# Altium project nnts.PrjPcb (part 1 of 3)
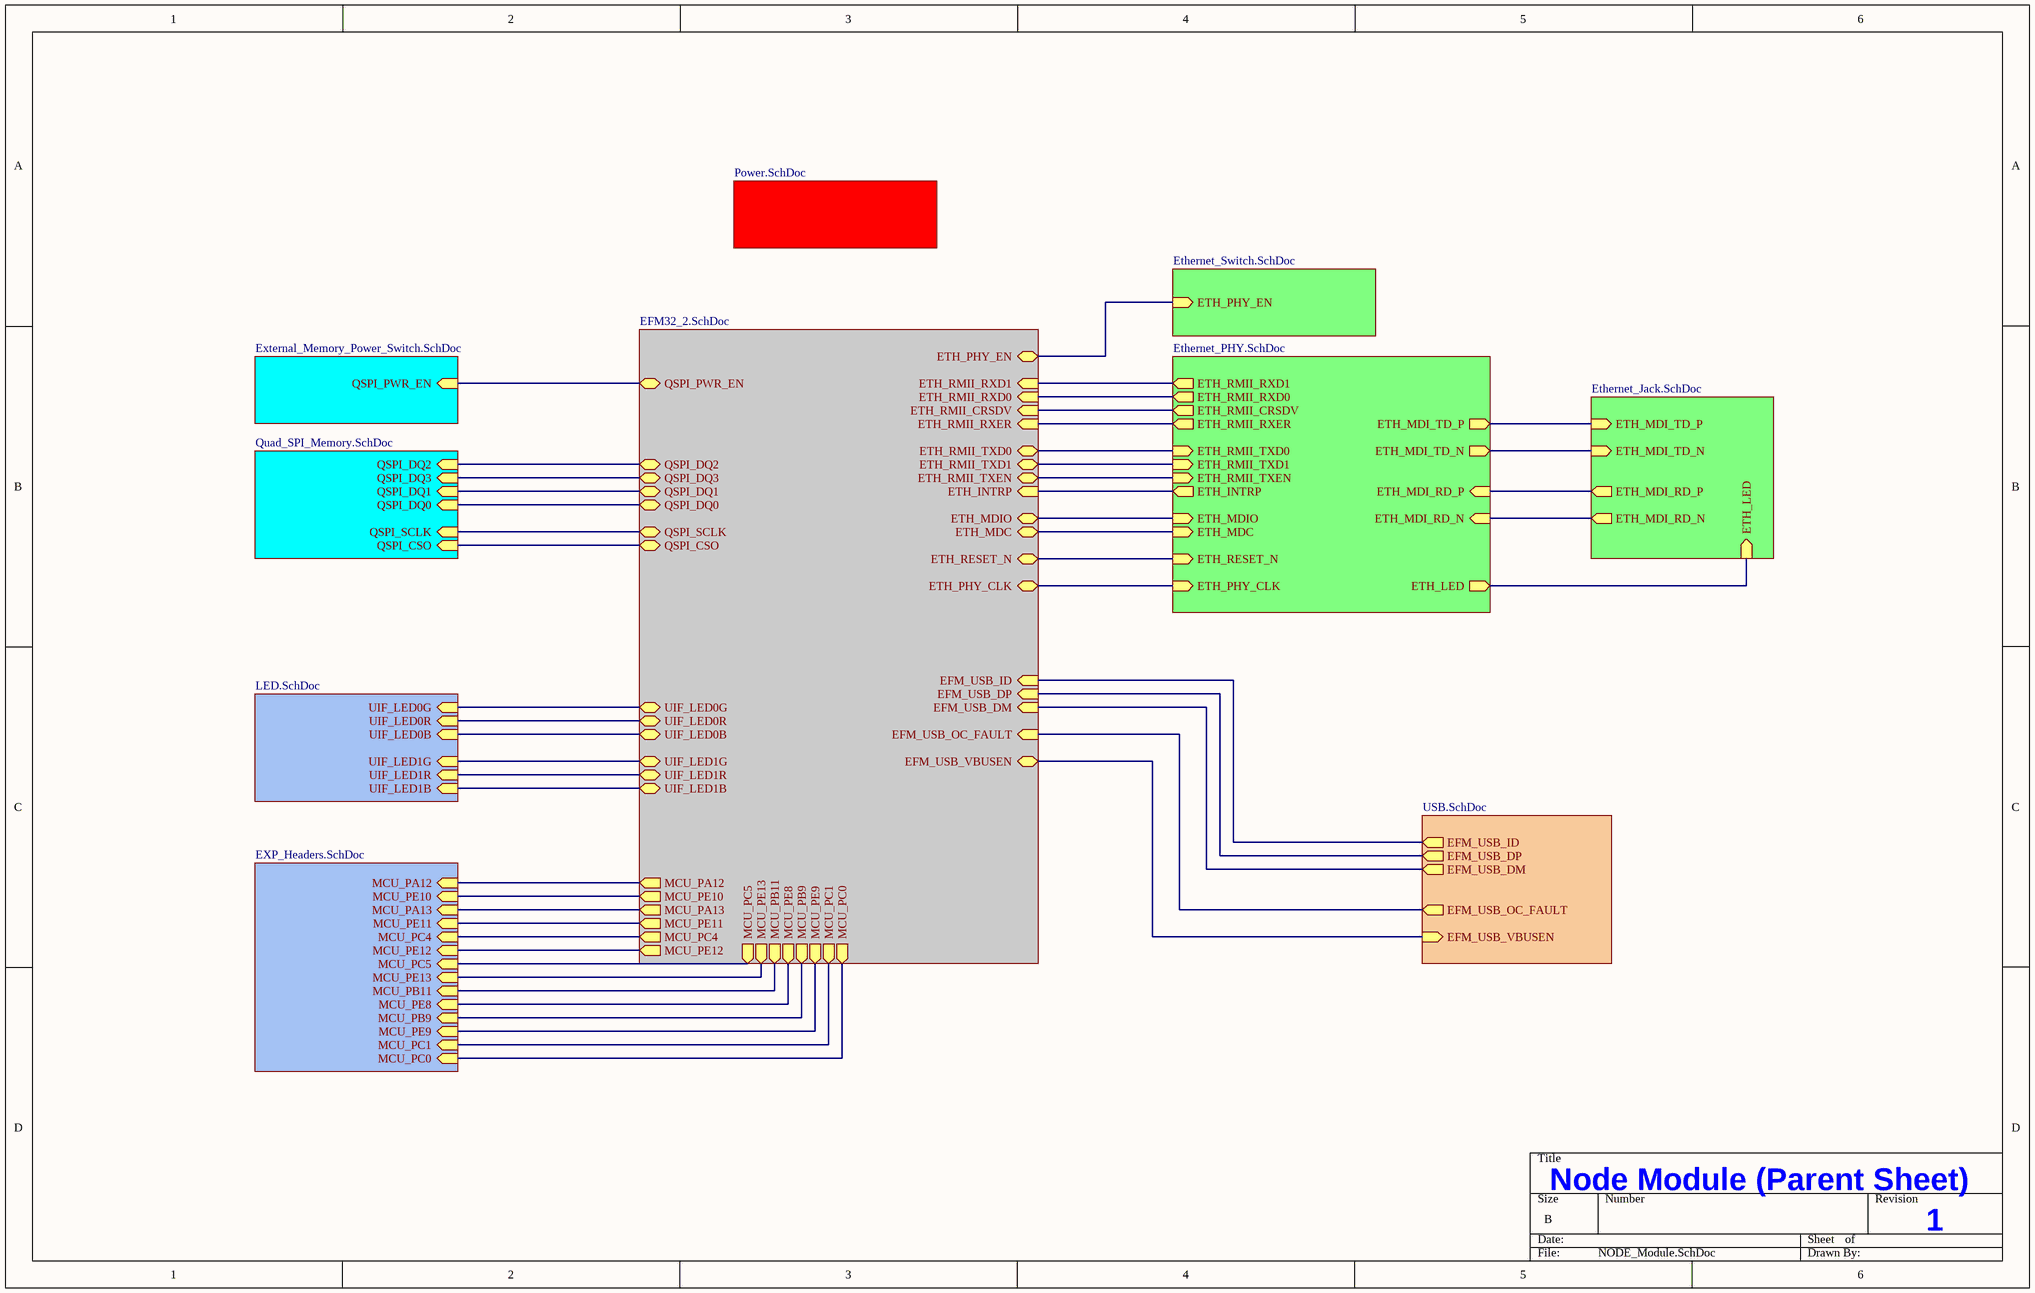
[diagram p0: NODE_Module.SchDoc]
Title: NNTS
11 sheets, 95 parts. Net scope: hierarchical (ports join the sheet entries above them; power ports are global).
Board file: NODE_Module.PcbDoc
Sheets:
  NODE_Module.SchDoc
    U_Ethernet_Jack = Ethernet_Jack.SchDoc
    U_Ethernet_Switch = Ethernet_Switch.SchDoc
    U_Quad_SPI_Memory = Quad_SPI_Memory.SchDoc
    U_External_Memory_Power_Switch = External_Memory_Power_Switch.SchDoc
    U_USB = USB.SchDoc
    U_Power = Power.SchDoc
    U_EXP_Headers = EXP_Headers.SchDoc
    U_LED = LED.SchDoc
    U_Ethernet_PHY = Ethernet_PHY.SchDoc
    U_EFM32_2 = EFM32_2.SchDoc

## Sheet NODE_Module.SchDoc: Node Module (Parent Sheet)
size B; CompanyName: OUTATIME; DrawnBy: Brad Yuska; Engineer: Brad Yuska; Revision: 1

### Sub-sheets
U_EFM32_2 = EFM32_2.SchDoc: QSPI_CSO (bidir), QSPI_DQ0 (bidir), QSPI_DQ1 (bidir), QSPI_DQ2 (bidir), QSPI_DQ3 (bidir), MCU_PC0 (out), MCU_PC1 (out), MCU_PC4 (out), MCU_PC5 (out), MCU_PA12 (out), MCU_PA13 (out), MCU_PB9 (out), MCU_PB11 (out), MCU_PE13 (out), MCU_PE12 (out), MCU_PE11 (out), MCU_PE10 (out), MCU_PE9 (out), MCU_PE8 (out), ETH_RMII_RXER (in), ETH_RMII_CRSDV (in), ETH_PHY_CLK (bidir), ETH_RMII_RXD0 (in), ETH_RMII_RXD1 (in), ETH_RMII_TXEN (bidir), ETH_RMII_TXD0 (bidir), ETH_RMII_TXD1 (bidir), EFM_USB_VBUSEN (bidir), EFM_USB_ID (in), ETH_INTRP (in), EFM_USB_DP (in), EFM_USB_DM (in), QSPI_SCLK (bidir), ETH_MDC (bidir), ETH_MDIO (bidir), ETH_PHY_EN (bidir), EFM_USB_OC_FAULT (in), UIF_LED0G (bidir), UIF_LED1R (bidir), UIF_LED0B (bidir), UIF_LED1G (bidir), UIF_LED1B (bidir), UIF_LED0R (bidir), ETH_RESET_N (bidir), QSPI_PWR_EN (bidir)
U_Ethernet_Jack = Ethernet_Jack.SchDoc: ETH_MDI_TD_P (in), ETH_MDI_TD_N (in), ETH_MDI_RD_P (out), ETH_MDI_RD_N (out), ETH_LED (in)
U_Ethernet_PHY = Ethernet_PHY.SchDoc: ETH_MDI_RD_N (in), ETH_MDI_RD_P (in), ETH_MDI_TD_N (out), ETH_MDI_TD_P (out), ETH_RESET_N (in), ETH_LED (out), ETH_INTRP (out), ETH_RMII_TXD1 (in), ETH_RMII_TXD0 (in), ETH_RMII_TXEN (in), ETH_RMII_RXD1 (out), ETH_RMII_RXD0 (out), ETH_RMII_RXER (out), ETH_RMII_CRSDV (out), ETH_PHY_CLK (in), ETH_MDIO (in), ETH_MDC (in)
U_Ethernet_Switch = Ethernet_Switch.SchDoc: ETH_PHY_EN (in)
U_EXP_Headers = EXP_Headers.SchDoc: MCU_PA12 (in), MCU_PE10 (in), MCU_PA13 (in), MCU_PE11 (in), MCU_PC4 (in), MCU_PE12 (in), MCU_PC5 (in), MCU_PE13 (in), MCU_PB11 (in), MCU_PE8 (in), MCU_PB9 (in), MCU_PE9 (in), MCU_PC1 (in), MCU_PC0 (in)
U_External_Memory_Power_Switch = External_Memory_Power_Switch.SchDoc: QSPI_PWR_EN (in)
U_LED = LED.SchDoc: UIF_LED0G (in), UIF_LED0R (in), UIF_LED0B (in), UIF_LED1G (in), UIF_LED1R (in), UIF_LED1B (in)
U_Power = Power.SchDoc: no entries
U_Quad_SPI_Memory = Quad_SPI_Memory.SchDoc: QSPI_DQ2 (in), QSPI_DQ3 (in), QSPI_DQ1 (in), QSPI_DQ0 (in), QSPI_SCLK (in), QSPI_CSO (in)
U_USB = USB.SchDoc: EFM_USB_VBUSEN (in), EFM_USB_OC_FAULT (out), EFM_USB_ID (out), EFM_USB_DP (out), EFM_USB_DM (out)

### Nets
NetD1_11: sheet U_Ethernet_Jack/ETH_MDI_RD_N, sheet U_Ethernet_PHY/ETH_MDI_RD_N
NetD1_12: sheet U_Ethernet_Jack/ETH_MDI_RD_P, sheet U_Ethernet_PHY/ETH_MDI_RD_P
NetD1_13: sheet U_Ethernet_Jack/ETH_MDI_TD_N, sheet U_Ethernet_PHY/ETH_MDI_TD_N
NetD1_14: sheet U_Ethernet_Jack/ETH_MDI_TD_P, sheet U_Ethernet_PHY/ETH_MDI_TD_P
NetD3_1: sheet U_USB/EFM_USB_ID, sheet U_EFM32_2/EFM_USB_ID
NetP2_3: sheet U_EXP_Headers/MCU_PA12, sheet U_EFM32_2/MCU_PA12
NetP2_4: sheet U_EXP_Headers/MCU_PE10, sheet U_EFM32_2/MCU_PE10
NetP2_5: sheet U_EXP_Headers/MCU_PA13, sheet U_EFM32_2/MCU_PA13
NetP2_6: sheet U_EXP_Headers/MCU_PE11, sheet U_EFM32_2/MCU_PE11
NetP2_7: sheet U_EXP_Headers/MCU_PC4, sheet U_EFM32_2/MCU_PC4
NetP2_8: sheet U_EXP_Headers/MCU_PE12, sheet U_EFM32_2/MCU_PE12
NetP2_9: sheet U_EXP_Headers/MCU_PC5, sheet U_EFM32_2/MCU_PC5
NetP2_10: sheet U_EXP_Headers/MCU_PE13, sheet U_EFM32_2/MCU_PE13
NetP2_11: sheet U_EXP_Headers/MCU_PB11, sheet U_EFM32_2/MCU_PB11
NetP2_12: sheet U_EXP_Headers/MCU_PE8, sheet U_EFM32_2/MCU_PE8
NetP2_13: sheet U_EXP_Headers/MCU_PB9, sheet U_EFM32_2/MCU_PB9
NetP2_14: sheet U_EXP_Headers/MCU_PE9, sheet U_EFM32_2/MCU_PE9
NetP2_15: sheet U_EXP_Headers/MCU_PC1, sheet U_EFM32_2/MCU_PC1
NetP2_16: sheet U_EXP_Headers/MCU_PC0, sheet U_EFM32_2/MCU_PC0
NetR1_1: sheet U_Ethernet_PHY/ETH_PHY_CLK, sheet U_EFM32_2/ETH_PHY_CLK
NetR2_2: sheet U_Ethernet_PHY/ETH_INTRP, sheet U_EFM32_2/ETH_INTRP
NetR3_1: sheet U_Ethernet_PHY/ETH_MDIO, sheet U_EFM32_2/ETH_MDIO
NetR9_1: sheet U_Ethernet_Jack/ETH_LED, sheet U_Ethernet_PHY/ETH_LED
NetR10_2: sheet U_Ethernet_Switch/ETH_PHY_EN, sheet U_EFM32_2/ETH_PHY_EN
NetR11_1: sheet U_Quad_SPI_Memory/QSPI_CSO, sheet U_EFM32_2/QSPI_CSO
NetR12_2: sheet U_Quad_SPI_Memory/QSPI_SCLK, sheet U_EFM32_2/QSPI_SCLK
NetR13_2: sheet U_External_Memory_Power_Switch/QSPI_PWR_EN, sheet U_EFM32_2/QSPI_PWR_EN
NetR15_2: sheet U_USB/EFM_USB_DP, sheet U_EFM32_2/EFM_USB_DP
NetR16_2: sheet U_USB/EFM_USB_DM, sheet U_EFM32_2/EFM_USB_DM
NetR17_1: sheet U_USB/EFM_USB_VBUSEN, sheet U_EFM32_2/EFM_USB_VBUSEN
NetR18_2: sheet U_USB/EFM_USB_OC_FAULT, sheet U_EFM32_2/EFM_USB_OC_FAULT
NetR22_1: sheet U_LED/UIF_LED0G, sheet U_EFM32_2/UIF_LED0G
NetR23_1: sheet U_LED/UIF_LED1G, sheet U_EFM32_2/UIF_LED1G
NetR24_1: sheet U_LED/UIF_LED0R, sheet U_EFM32_2/UIF_LED0R
NetR25_1: sheet U_LED/UIF_LED1R, sheet U_EFM32_2/UIF_LED1R
NetR26_1: sheet U_LED/UIF_LED0B, sheet U_EFM32_2/UIF_LED0B
NetR27_1: sheet U_LED/UIF_LED1B, sheet U_EFM32_2/UIF_LED1B
NetRP1_1: sheet U_Ethernet_PHY/ETH_RMII_RXD1, sheet U_EFM32_2/ETH_RMII_RXD1
NetRP1_2: sheet U_Ethernet_PHY/ETH_RMII_RXD0, sheet U_EFM32_2/ETH_RMII_RXD0
NetRP1_3: sheet U_Ethernet_PHY/ETH_RMII_RXER, sheet U_EFM32_2/ETH_RMII_RXER
NetRP1_4: sheet U_Ethernet_PHY/ETH_RMII_CRSDV, sheet U_EFM32_2/ETH_RMII_CRSDV
NetRP2_1: sheet U_Quad_SPI_Memory/QSPI_DQ3, sheet U_EFM32_2/QSPI_DQ3
NetRP2_2: sheet U_Quad_SPI_Memory/QSPI_DQ2, sheet U_EFM32_2/QSPI_DQ2
NetRP2_3: sheet U_Quad_SPI_Memory/QSPI_DQ1, sheet U_EFM32_2/QSPI_DQ1
NetRP2_4: sheet U_Quad_SPI_Memory/QSPI_DQ0, sheet U_EFM32_2/QSPI_DQ0
NetU1_11: sheet U_Ethernet_PHY/ETH_MDC, sheet U_EFM32_2/ETH_MDC
NetU1_19: sheet U_Ethernet_PHY/ETH_RMII_TXEN, sheet U_EFM32_2/ETH_RMII_TXEN
NetU1_20: sheet U_Ethernet_PHY/ETH_RMII_TXD0, sheet U_EFM32_2/ETH_RMII_TXD0
NetU1_21: sheet U_Ethernet_PHY/ETH_RMII_TXD1, sheet U_EFM32_2/ETH_RMII_TXD1
NetU1_24: sheet U_Ethernet_PHY/ETH_RESET_N, sheet U_EFM32_2/ETH_RESET_N

## Sheet Ethernet_Jack.SchDoc: Ethernet Jack
size A; Revision: 1
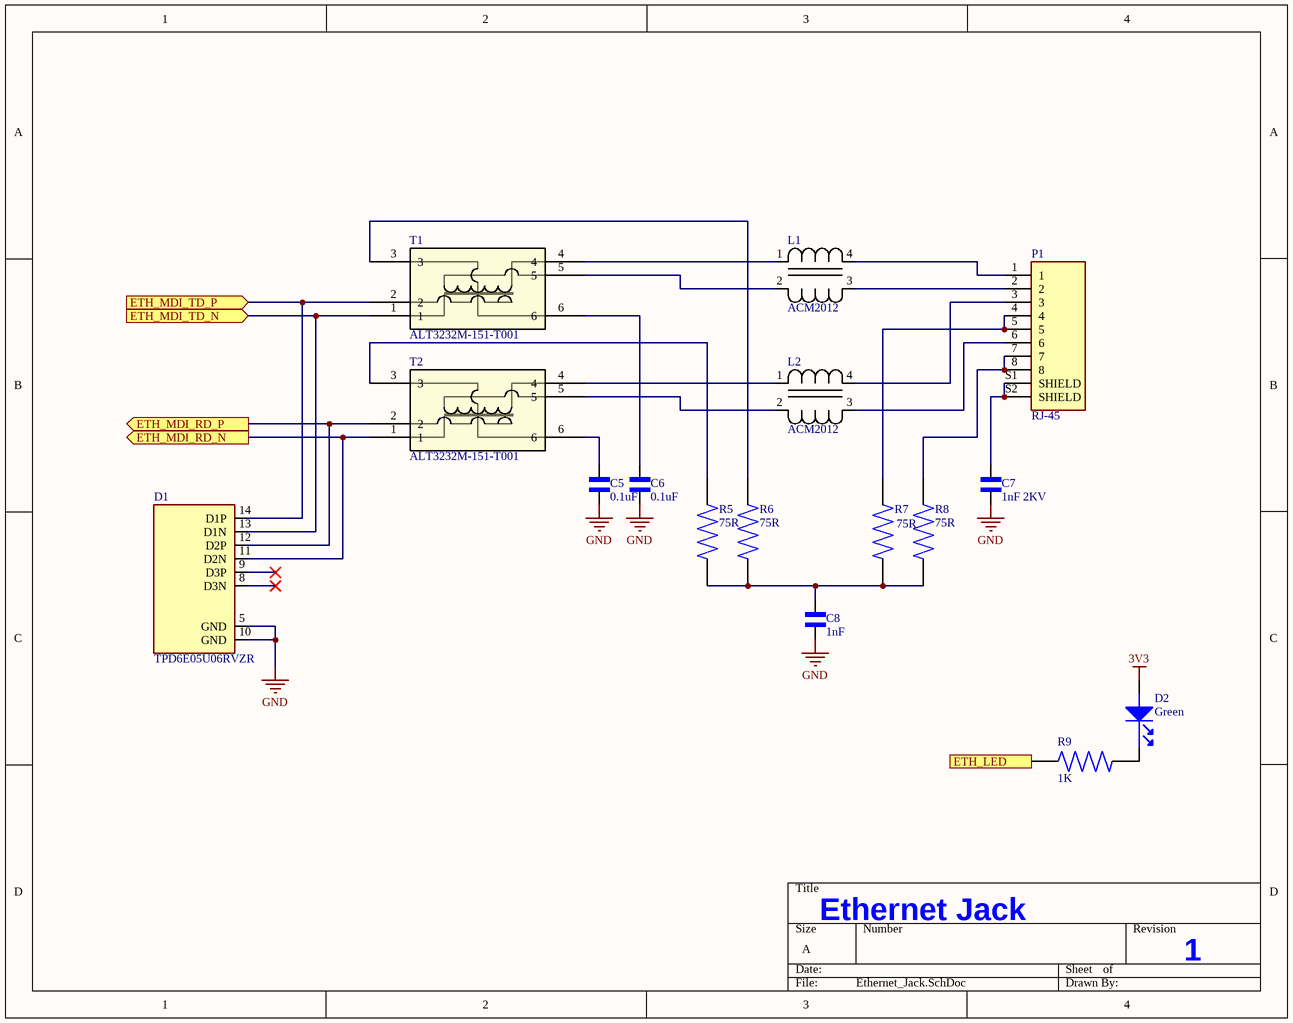
[diagram p1: Ethernet_Jack.SchDoc]

### Parts
C5  0.1uF  [C0402]
C6  0.1uF  [C0402]
C7  1nF 2KV  [RESC1206X70N]
C8  1nF  [C0402]
D1  TPD6E05U06RVZR  [SON50P135X350X55-14N]
D2  Green  [LED_0603]
L1  ACM2012  [IND_TDK_ACM2012_2P_TDK-M]
L2  ACM2012  [IND_TDK_ACM2012_2P_TDK-M]
P1  RJ-45  [TE_1-406541-5]
R5  75R  [R0402 Vishay]
R6  75R  [R0402 Vishay]
R7  75R  [R0402 Vishay]
R8  75R  [R0402 Vishay]
R9  1K  [R0603 Vishay]
T1  ALT3232M-151-T001  [ALT3232M-151-T001]
T2  ALT3232M-151-T001  [ALT3232M-151-T001]

### Ports
ETH_LED (in), ETH_MDI_RD_N (out), ETH_MDI_RD_P (out), ETH_MDI_TD_N (in), ETH_MDI_TD_P (in)

### Nets
3V3: D2.1(Anode)
GND: C5.1 C6.1 C7.1 C8.1 D1.5(GND) D1.10(GND)
NetC5_2: C5.2 T2.6
NetC6_2: C6.2 T1.6
NetC7_2: C7.2 P1.S1(SHIELD) P1.S2(SHIELD)
NetC8_2: C8.2 R5.1 R6.1 R7.1 R8.1
NetD1_11: D1.11(D2N) T2.1 ; port ETH_MDI_RD_N
NetD1_12: D1.12(D2P) T2.2 ; port ETH_MDI_RD_P
NetD1_13: D1.13(D1N) T1.1 ; port ETH_MDI_TD_N
NetD1_14: D1.14(D1P) T1.2 ; port ETH_MDI_TD_P
NetD2_2: D2.2(Cathode) R9.2
NetL1_1: L1.1 T1.4
NetL1_2: L1.2 T1.5
NetL1_3: L1.3 P1.2
NetL1_4: L1.4 P1.1
NetL2_1: L2.1 T2.4
NetL2_2: L2.2 T2.5
NetL2_3: L2.3 P1.6
NetL2_4: L2.4 P1.3
NetP1_4: P1.4 P1.5 R7.2
NetP1_7: P1.7 P1.8 R8.2
NetR5_2: R5.2 T2.3
NetR6_2: R6.2 T1.3
NetR9_1: R9.1 ; port ETH_LED

Not connected (* = marked no-connect by the designer): D1 8(D3N)* 9(D3P)*

### Library data of the parts
C5 C6 = GRM022R60J104KE15L: CAP CER 0.1UF 6.3V X5R 01005; Manufacturer: Murata; Capacitance: 100nF; Tolerance: 10%; Supplier 1: Digi-Key; Manufacturer Part Number: GRM022R60J104KE15L; RoHS: No; Category: Ceramic Capacitors; Stock 1: 633064; Pricing 1: 1=0.13000, 10=0.09000, 50=0.05080, 100=0.04210, 500=0.02952, 1000=0.02444, 2500=0.02275, 5000=0.02081 (USD); Mount: Surface Mount; Case Code (Imperial): 1005; Case Code (Metric): 0402; Min Operating Temperature: -55°C; Max Operating Temperature: 85°C; Packaging: Cut Tape; Voltage Rating: 6.3V; ComponentLink1URL: http://search.murata.co.jp/Ceramy/image/img/A01X/G101/ENG/GRM022R60J104KE15-01.pdf?src-supplier=Digi-Key; ComponentLink1Description: http://search.murata.co.jp/Ceramy/image/img/A01X/G101/ENG/GRM022R60J104KE15-01.pdf?src-supplier=Digi-Key; Supplier Part Number 1: 490-16598-1-ND
C7 = 1206GC102KAT3A: 1206 1000 pF 2000 V ±10 % Tolerance X7R SMT Multilayer Ceramic Capacitor; Manufacturer: Kyocera AVX; Tolerance: 10%; Supplier 1: Mouser; Manufacturer Part Number: 1206GC102KAT3A; RoHS: Yes; Category: Ceramic Capacitors; Stock 1: 40204; Pricing 1: 1=0.37000, 10=0.27700, 100=0.16600, 500=0.12500, 1000=0.10800, 2500=0.08900 (USD); Mount: Surface Mount; Case/Package: 1206; Case Code (Imperial): 1206; Case Code (Metric): 3216; Min Operating Temperature: -55°C; Max Operating Temperature: 125°C; Capacitance: 1nF; Packaging: Tape and Reel; Package Quantity: 10000; Voltage Rating: 2kV; Dielectric: X7R; Voltage Rating (DC): 2kV; Termination: SMD/SMT; Length: 3.2mm; Depth: 1.6mm; ComponentLink1URL: https://datasheet.ciiva.com/13205/aphvc-13205007.pdf?src-supplier=Mouser; ComponentLink1Description: https://datasheet.ciiva.com/13205/aphvc-13205007.pdf?src-supplier=Mouser; Supplier Part Number 1: 581-1206GC102KAT3A
C8 = GRM155R60J102KA01D: 0402 1 nF 6.3 V ±10% Tolerance X5R SMT Multilayer Ceramic Capacitor; Manufacturer: Murata; Voltage Rating: 6.3V; Supplier 1: Digi-Key; Manufacturer Part Number: GRM155R60J102KA01D; RoHS: Yes; Category: Ceramic Capacitors; Stock 1: 20431; Pricing 1: 1=0.10000, 10=0.02800, 50=0.01520, 100=0.01240, 500=0.00886, 1000=0.00696, 2500=0.00632, 5000=0.00582 (USD); Mount: Surface Mount; Case/Package: 0402; Case Code (Metric): 1005; Case Code (Imperial): 0402; Min Operating Temperature: -55°C; Max Operating Temperature: 85°C; Package Quantity: 10000; Capacitance: 1nF; Tolerance: 10%; Packaging: Tape and Reel; Voltage Rating (DC): 6.3V; Dielectric: X5R; Termination: SMD/SMT; Voltage: 6.3V; Length: 1mm; Width: 0.02inch; Height: 0.5mm; Thickness: 0.022inch; Depth: 0.5mm; Radiation Hardening: No; Lead Free: Lead Free; ComponentLink1URL: https://datasheet.ciiva.com/6263/product-6263681.pdf?src-supplier=Digi-Key; ComponentLink1Description: https://datasheet.ciiva.com/6263/product-6263681.pdf?src-supplier=Digi-Key; ComponentLink2URL: https://datasheet.ciiva.com/6263/partnumbering-e-01-6263685.pdf?src-supplier=Digi-Key; ComponentLink2Description: https://datasheet.ciiva.com/6263/partnumbering-e-01-6263685.pdf?src-supplier=Digi-Key; ComponentLink3URL: https://datasheet.ciiva.com/6263/partnumbering-e-01-6263677.pdf?src-supplier=Digi-Key; ComponentLink3Description: https://datasheet.ciiva.com/6263/partnumbering-e-01-6263677.pdf?src-supplier=Digi-Key; Supplier Part Number 1: 490-6285-1-ND
D1 = TPD6E05U06RVZR: TVS DIODE 5.5V 14V 14USON (ESD Protection for PHY); Manufacturer: Texas Instruments; Peak Pulse Current: 2.5A; Number of Bidirectional Channels: 6; Min Breakdown Voltage: 6V; Peak Pulse Power: 40W; Power Line Protection: Yes; Polarity: Bidirectional; Leakage Current: 10nA; Interface: LVDS,USB,Ethernet,HDMI,PCIe,SATA; Direction: Unidirectional; Supplier 1: Digi-Key; Manufacturer Part Number: TPD6E05U06RVZR; RoHS: Yes; Category: ESD and Circuit Protection ICs; Stock 1: 12287; Pricing 1: 1=0.80000, 10=0.66000, 100=0.47930, 500=0.38340, 1000=0.30885 (USD); Mount: Surface Mount; Number of Pins: 14; Min Operating Temperature: -40°C; Max Operating Temperature: 125°C; Packaging: Tape and Reel; Package Quantity: 3000; Reverse Standoff Voltage: 5.5V; Clamping Voltage: 14V; Number of Channels: 6; Breakdown Voltage: 6V; Termination: SMD/SMT; Max Power Dissipation: 40W; Working Voltage: 5.5V; Length: 3.6mm; Depth: 1.45mm; Radiation Hardening: No; Lead Free: Lead Free; ComponentLink1URL: https://datasheet.ciiva.com/29883/tpd6e05u06-29883847.pdf?src-supplier=Avnet; ComponentLink1Description: https://datasheet.ciiva.com/29883/tpd6e05u06-29883847.pdf?src-supplier=Avnet; ComponentLink2URL: https://datasheet.ciiva.com/26918/getdatasheetpartid-747210-26918045.pdf?src-supplier=Verical; ComponentLink2Description: https://datasheet.ciiva.com/26918/getdatasheetpartid-747210-26918045.pdf?src-supplier=Verical; Supplier Part Number 1: 296-39349-1-ND
D2 = LGL29K-G2J1-24-Z: LED Uni-Color Green 572nm 2-Pin Chip 0603(1608Metric) T/R; Manufacturer: Osram Opto; Lens Color: White; Forward Current: 20mA; Forward Voltage: 2.2V; Luminous Intensity: 5.6mcd; Viewing Angle: 160°; Number of LEDs: 1; Lens Style: Flat,Diffused,Colorless,Rectangular; Lens Transparency: Diffused; Reverse Voltage: 12V; Test Current: 2mA; Dominant Wavelength: 570nm; Luminous Flux: 0.012lm; Lens Size: 0.8mm; Supplier 1: Digi-Key; Manufacturer Part Number: LGL29K-G2J1-24-Z; RoHS: Yes; Category: Uncategorized; Stock 1: 112400; Pricing 1: 1=0.42000, 10=0.30400, 100=0.19830, 500=0.14250, 1000=0.11153, 2500=0.10224 (USD); Mount: Surface Mount; Case/Package: 0603; Number of Pins: 2; Case Code (Imperial): 0603; Case Code (Metric): 1608; Color: Green; Min Operating Temperature: -40°C; Max Operating Temperature: 100°C; Illumination Color: Green; Packaging: Tape and Reel; Package Quantity: 5000; Number of Elements: 1; Length: 1.3mm; Height: 0.65mm; Width: 0.8mm; Depth: 0.8mm; Radiation Hardening: No; ComponentLink1URL: https://datasheet.ciiva.com/4689/g-l29k-39844-4689584.pdf?src-supplier=Mouser; ComponentLink1Description: https://datasheet.ciiva.com/4689/g-l29k-39844-4689584.pdf?src-supplier=Mouser; ComponentLink2URL: https://datasheet.ciiva.com/15198/getdatasheetpartid-571127-15198411.pdf?src-supplier=Verical; ComponentLink2Description: https://datasheet.ciiva.com/15198/getdatasheetpartid-571127-15198411.pdf?src-supplier=Verical; ComponentLink3URL: https://datasheet.ciiva.com/2112/00077107-0-2112886.pdf?src-supplier=Digi-Key; ComponentLink3Description: https://datasheet.ciiva.com/2112/00077107-0-2112886.pdf?src-supplier=Digi-Key; ComponentLink4URL: https://datasheet.ciiva.com/2112/00077107-0-2112887.pdf?src-supplier=Digi-Key; ComponentLink4Description: https://datasheet.ciiva.com/2112/00077107-0-2112887.pdf?src-supplier=Digi-Key; ComponentLink5URL: https://datasheet.ciiva.com/2112/00077107-0-2112888.pdf?src-supplier=Digi-Key; ComponentLink5Description: https://datasheet.ciiva.com/2112/00077107-0-2112888.pdf?src-supplier=Digi-Key; Supplier Part Number 1: 475-2709-1-ND
L1 L2 = ACM2012-121-2P-T002: TDK - ACM2012-121-2P-T002 - Filter, Common Mode, ACM Series, 120 ohm, 370 mA, 2mm x 1.2mm x 1.3mm; Impedance: 120R; Voltage Rating: 50V; Number of Lines: 2; Current Rating: 370mA; DC Resistance (DCR): 220mR; Test Frequency: 100MHz; Shielding: Shielded; Supplier 1: Digi-Key; Manufacturer: TDK; Manufacturer Part Number: ACM2012-121-2P-T002; RoHS: Yes; Category: Common Mode Chokes; Stock 1: 21794; Pricing 1: 1=0.45000, 10=0.39200, 25=0.36400, 50=0.30800, 100=0.28000, 250=0.26320, 500=0.23520, 1000=0.19040 (USD); Mount: Surface Mount; Case/Package: 0805; Min Operating Temperature: -40°C; Max Operating Temperature: 85°C; Package Quantity: 1; Packaging: Tape and Reel; Voltage Rating (DC): 50V; Max DC Current: 370mA; Termination: SMD/SMT; Current: 370mA; Length: 2mm; Width: 1.2mm; Height: 1.3mm; Depth: 1.2mm; REACH SVHC: No SVHC; Lead Free: Lead Free; ComponentLink1URL: https://datasheet.ciiva.com/26793/acm2012-121-2p-t002-26793322.pdf?src-supplier=IIIC; ComponentLink1Description: https://datasheet.ciiva.com/26793/acm2012-121-2p-t002-26793322.pdf?src-supplier=IIIC; ComponentLink2URL: https://datasheet.ciiva.com/1007/e9712-acm-1007629.pdf?src-supplier=Digi-Key; ComponentLink2Description: https://datasheet.ciiva.com/1007/e9712-acm-1007629.pdf?src-supplier=Digi-Key; ComponentLink3URL: https://datasheet.ciiva.com/1007/e9712-acm-1007630.pdf?src-supplier=Digi-Key; ComponentLink3Description: https://datasheet.ciiva.com/1007/e9712-acm-1007630.pdf?src-supplier=Digi-Key; ComponentLink4URL: https://datasheet.ciiva.com/1007/e9712-acm-1007631.pdf?src-supplier=Digi-Key; ComponentLink4Description: https://datasheet.ciiva.com/1007/e9712-acm-1007631.pdf?src-supplier=Digi-Key; ComponentLink5URL: https://datasheet.ciiva.com/16416/e9719-acm2012-16416519.pdf?src-supplier=Future+Electronics; ComponentLink5Description: https://datasheet.ciiva.com/16416/e9719-acm2012-16416519.pdf?src-supplier=Future+Electronics; ComponentLink6URL: https://datasheet.ciiva.com/46450/1750020-46450935.pdf?src-supplier=Element14; ComponentLink6Description: https://datasheet.ciiva.com/46450/1750020-46450935.pdf?src-supplier=Element14; Supplier Part Number 1: 445-2208-1-ND
P1 = 1-406541-5: Conn RJ-45 F 8 POS 2.04mm Solder RA Thru-Hole 8 Terminal 1 Port Tray Cat 5; Manufacturer: TE Connectivity; Keyed: No; Element Configuration: Single; Shielding: Shielded; Max Voltage Rating (AC): 150V; Number of Ports: 1; Number of Positions: 8; PCB Mounting Orientation: Right Angle; Connector Type: Jack; Gender: Female; Direction: Up; Tail Length: 2.54mm; PCB Thickness: 1.57mm; Supplier 1: Digi-Key; Manufacturer Part Number: 1-406541-5; RoHS: Yes; Category: Modular / Ethernet Connectors; Stock 1: 2926; Pricing 1: 1=2.85000, 10=2.73200, 25=2.50440, 50=2.39040, 100=2.27660, 250=1.99208, 500=1.93514, 1000=1.65056, 2500=1.53673 (USD); Mount: Panel; Housing Material: Thermoplastic; Contact Plating: Gold; Contact Material: Bronze; Housing Color: Black; Min Operating Temperature: -40°C; Max Operating Temperature: 80°C; Termination: Solder; Orientation: Right Angle; Packaging: Tray; Package Quantity: 441; Number of Positions Loaded: 8; Number of Contacts: 8; Number of Rows: 1; Length: 17.27mm; Pitch: 2.04mm; Depth: 15.75mm; Radiation Hardening: No; Flammability Rating: UL94 V-0; REACH SVHC: Unknown; ComponentLink1URL: https://datasheet.ciiva.com/30494/0900766b8121d3cc-30494417.pdf?src-supplier=RSComponents; ComponentLink1Description: https://datasheet.ciiva.com/30494/0900766b8121d3cc-30494417.pdf?src-supplier=RSComponents; ComponentLink2URL: https://datasheet.ciiva.com/1107/1652951-1107156.pdf?src-supplier=Element14; ComponentLink2Description: https://datasheet.ciiva.com/1107/1652951-1107156.pdf?src-supplier=Element14; ComponentLink3URL: https://datasheet.ciiva.com/16324/eng-cd-406541-m8-16324678.pdf?src-supplier=Future+Electronics; ComponentLink3Description: https://datasheet.ciiva.com/16324/eng-cd-406541-m8-16324678.pdf?src-supplier=Future+Electronics; ComponentLink4URL: https://datasheet.ciiva.com/23759/1509418-23759355.pdf?src-supplier=Newark; ComponentLink4Description: https://datasheet.ciiva.com/23759/1509418-23759355.pdf?src-supplier=Newark; ComponentLink5URL: https://datasheet.ciiva.com/16548/eng-cd-406541-j-16548134.pdf?src-supplier=Avnet+Europe; ComponentLink5Description: https://datasheet.ciiva.com/16548/eng-cd-406541-j-16548134.pdf?src-supplier=Avnet+Europe; ComponentLink6URL: https://datasheet.ciiva.com/26824/getdatasheetpartid-242299-26824299.pdf?src-supplier=Verical; ComponentLink6Description: https://datasheet.ciiva.com/26824/getdatasheetpartid-242299-26824299.pdf?src-supplier=Verical; Supplier Part Number 1: A102038-ND
R5-R8 = CRCW040275R0FKED: VISHAY         CRCW040275R0FKED.            Surface Mount Chip Resistor, Thick Film, AEC-Q200 CRCW Series, 75 ohm, 63 mW,  1%, 50 V; Power Rating: 63mW; Temperature Coefficient: 100ppm/°C; Voltage Rating: 50V; Supplier 1: Digi-Key; Manufacturer: Vishay; Manufacturer Part Number: CRCW040275R0FKED; RoHS: Yes; Category: Chip SMD Resistors; Stock 1: 3085; Pricing 1: 1=0.10000, 10=0.03300, 100=0.01330, 1000=0.00596, 2500=0.00518, 5000=0.00428 (USD); Case/Package: 0402; Contact Plating: Tin; Weight: 2.3E-05oz; Case Code (Imperial): 0402; Case Code (Metric): 1005; Min Operating Temperature: -55°C; Max Operating Temperature: 155°C; Resistance: 75R; Tolerance: 1%; Resistor Type: Thick Film; Termination: SMD/SMT; Packaging: Tape and Reel; Package Quantity: 10; Number of Terminations: 2; Max Power Dissipation: 63mW; Voltage Rating (DC): 50V; Working Voltage: 50V; Features: Automotive AEC-Q200; Length: 1mm; Width: 0.5mm; Height: 0.35mm; Depth: 0.5mm; Radiation Hardening: No; Lead Free: Lead Free; REACH SVHC: Unknown; Military Standard: Not; ComponentLink1URL: https://datasheet.ciiva.com/11811/0900766b80d98824-11811348.pdf?src-supplier=RSComponents; ComponentLink1Description: https://datasheet.ciiva.com/11811/0900766b80d98824-11811348.pdf?src-supplier=RSComponents; ComponentLink2URL: https://datasheet.ciiva.com/2463/dcrcwe3-2463217.pdf?src-supplier=Digi-Key; ComponentLink2Description: https://datasheet.ciiva.com/2463/dcrcwe3-2463217.pdf?src-supplier=Digi-Key; ComponentLink3URL: https://datasheet.ciiva.com/2463/dcrcwe3-2463218.pdf?src-supplier=Digi-Key; ComponentLink3Description: https://datasheet.ciiva.com/2463/dcrcwe3-2463218.pdf?src-supplier=Digi-Key; ComponentLink4URL: https://datasheet.ciiva.com/2463/dcrcwe3-2463219.pdf?src-supplier=Digi-Key; ComponentLink4Description: https://datasheet.ciiva.com/2463/dcrcwe3-2463219.pdf?src-supplier=Digi-Key; ComponentLink5URL: https://datasheet.ciiva.com/16779/70201119-16779527.pdf?src-supplier=Allied+Electronics; ComponentLink5Description: https://datasheet.ciiva.com/16779/70201119-16779527.pdf?src-supplier=Allied+Electronics; ComponentLink6URL: https://datasheet.ciiva.com/16885/dcrcwe3-16885703.pdf?src-supplier=Avnet+Europe; ComponentLink6Description: https://datasheet.ciiva.com/16885/dcrcwe3-16885703.pdf?src-supplier=Avnet+Europe; ComponentLink7URL: https://datasheet.ciiva.com/7673/1697337-7673451.pdf?src-supplier=Element14; ComponentLink7Description: https://datasheet.ciiva.com/7673/1697337-7673451.pdf?src-supplier=Element14; ComponentLink8URL: https://datasheet.ciiva.com/7673/1697337-7673279.pdf?src-supplier=Element14; ComponentLink8Description: https://datasheet.ciiva.com/7673/1697337-7673279.pdf?src-supplier=Element14; Supplier Part Number 1: 541-75.0LCT-ND
R9 = CRCW02011K00FNED: Res Thick Film 0201 1K Ohm 1% 1/20W 200ppm/C Molded SMD SMD Paper T/R; Manufacturer: Vishay; Resistance: 1kR; Power Rating: 50mW; Voltage Rating: 30V; Temperature Coefficient: 200ppm/°C; Supplier 1: Digi-Key; Manufacturer Part Number: CRCW02011K00FNED; RoHS: Yes; Category: Chip SMD Resistors; Stock 1: 279214; Pricing 1: 1=0.10000, 10=0.05700, 100=0.02300, 1000=0.01034, 2500=0.00897, 5000=0.00741 (USD); Mount: Surface Mount; Case/Package: 0201; Number of Pins: 2; Weight: 6E-06oz; Case Code (Metric): 0603; Case Code (Imperial): 0201; Contact Plating: Tin; Min Operating Temperature: -55°C; Max Operating Temperature: 155°C; Packaging: Tape and Reel; Tolerance: 1%; Package Quantity: 1; Resistor Type: Thick Film; Number of Terminations: 2; Termination: SMD/SMT; Max Power Dissipation: 50mW; Voltage Rating (DC): 30V; Length: 0.6mm; Width: 0.012inch; Height: 0.011inch; Depth: 0.3mm; Radiation Hardening: No; REACH SVHC: Unknown; Military Standard: Not; Lead Free: Lead Free; ComponentLink1URL: https://datasheet.ciiva.com/2474/crcw0201e3-2474800.pdf?src-supplier=Digi-Key; ComponentLink1Description: https://datasheet.ciiva.com/2474/crcw0201e3-2474800.pdf?src-supplier=Digi-Key; ComponentLink2URL: https://datasheet.ciiva.com/2474/crcw0201e3-2474802.pdf?src-supplier=Digi-Key; ComponentLink2Description: https://datasheet.ciiva.com/2474/crcw0201e3-2474802.pdf?src-supplier=Digi-Key; ComponentLink3URL: https://datasheet.ciiva.com/22665/1825492-22665818.pdf?src-supplier=Element14; ComponentLink3Description: https://datasheet.ciiva.com/22665/1825492-22665818.pdf?src-supplier=Element14; ComponentLink4URL: https://datasheet.ciiva.com/7983/1719906-7983323.pdf?src-supplier=Element14; ComponentLink4Description: https://datasheet.ciiva.com/7983/1719906-7983323.pdf?src-supplier=Element14; ComponentLink5URL: https://datasheet.ciiva.com/7983/1719906-7983324.pdf?src-supplier=Element14; ComponentLink5Description: https://datasheet.ciiva.com/7983/1719906-7983324.pdf?src-supplier=Element14; ComponentLink6URL: https://datasheet.ciiva.com/2474/crcw0201e3-2474801.pdf?src-supplier=Digi-Key; ComponentLink6Description: https://datasheet.ciiva.com/2474/crcw0201e3-2474801.pdf?src-supplier=Digi-Key; ComponentLink7URL: https://datasheet.ciiva.com/3255/crcw0201e3-3255929.pdf?src-supplier=Avnet; ComponentLink7Description: https://datasheet.ciiva.com/3255/crcw0201e3-3255929.pdf?src-supplier=Avnet; ComponentLink8URL: https://datasheet.ciiva.com/22871/70202042-22871422.pdf?src-supplier=Allied+Electronics; ComponentLink8Description: https://datasheet.ciiva.com/22871/70202042-22871422.pdf?src-supplier=Allied+Electronics; ComponentLink9URL: https://datasheet.ciiva.com/22692/1719906-22692751.pdf?src-supplier=Element14; ComponentLink9Description: https://datasheet.ciiva.com/22692/1719906-22692751.pdf?src-supplier=Element14; Supplier Part Number 1: 541-1.00KABCT-ND
T1 T2 = ALT3232M-151-T001: t600,601; Built_By: EMA_Matt; Vendor: TDK; SourceLibrary: Add_to_database_2020-10-23; Type: DEV; Datasheet: https://product.tdk.com/info/en/catalog/datasheets/090007/trans_alt_en.pdf; Copyright: Copyright (C) 2018 Accelerated Designs. All rights reserved; Manufacturer_Part_Number: ALT3232M-151-T001; RefDes: RefDes

## Sheet Ethernet_Switch.SchDoc: Ethernet Switch
size A; Revision: 1
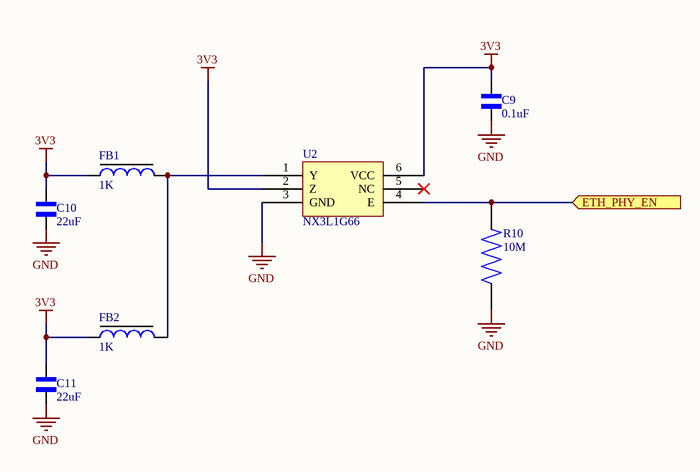
[diagram p2: Ethernet_Switch.SchDoc]

### Parts
C9  0.1uF  [C0402]
C10  22uF  [C0603]
C11  22uF  [C0603]
FB1  1K  [FB0402]
FB2  1K  [FB0402]
R10  10M  [R0402 Vishay]
U2  NX3L1G66  [PSON50P145X100X50-6N]

### Ports
ETH_PHY_EN (in)

### Nets
3V3: C9.2 C10.2 C11.2 FB1.1 FB2.1 U2.2(Z) U2.6(VCC)
GND: C9.1 C10.1 C11.1 R10.1 U2.3(GND)
NetFB1_2: FB1.2 FB2.2 U2.1(Y)
NetR10_2: R10.2 U2.4(E) ; port ETH_PHY_EN

Not connected (* = marked no-connect by the designer): U2 5(NC)*

### Library data of the parts
C9 = GRM022R60J104KE15L: as C5 on sheet Ethernet_Jack; Supplier 1: Digi-Key; Manufacturer Part Number: GRM022R60J104KE15L; RoHS: No; Category: Ceramic Capacitors; Stock 1: 633064; Pricing 1: 1=0.13000, 10=0.09000, 50=0.05080, 100=0.04210, 500=0.02952, 1000=0.02444, 2500=0.02275, 5000=0.02081 (USD); Mount: Surface Mount; Case Code (Imperial): 1005; Case Code (Metric): 0402; Min Operating Temperature: -55°C; Max Operating Temperature: 85°C; Packaging: Cut Tape; Voltage Rating: 6.3V; ComponentLink1URL: http://search.murata.co.jp/Ceramy/image/img/A01X/G101/ENG/GRM022R60J104KE15-01.pdf?src-supplier=Digi-Key; ComponentLink1Description: http://search.murata.co.jp/Ceramy/image/img/A01X/G101/ENG/GRM022R60J104KE15-01.pdf?src-supplier=Digi-Key; Supplier Part Number 1: 490-16598-1-ND
C10 C11 = ZRB18AR61A226ME01L: 0603 22 uF 10 V ±20% Tolerance X5R Surface Mount Multilayer Ceramic Capacitor; Manufacturer: Murata; Voltage Rating: 10V; Supplier 1: Mouser; Manufacturer Part Number: ZRB18AR61A226ME01L; RoHS: No; Category: Ceramic Capacitors; Stock 1: 179696; Pricing 1: 1=0.44000, 10=0.30400, 100=0.18300, 500=0.13700, 1000=0.11600, 3000=0.09500 (USD); Mount: Surface Mount; Case/Package: 0603; Min Operating Temperature: -55°C; Max Operating Temperature: 85°C; Packaging: Tape and Reel; Capacitance: 22uF; Tolerance: 20%; ComponentLink1URL: http://search.murata.co.jp/Ceramy/image/img/A01X/G101/ENG/ZRB18AR61A226ME01-02.pdf?src-supplier=Digi-Key; ComponentLink1Description: http://search.murata.co.jp/Ceramy/image/img/A01X/G101/ENG/ZRB18AR61A226ME01-02.pdf?src-supplier=Digi-Key; Supplier Part Number 1: 81-ZRB18AR61A226ME1L
FB1 FB2 = BLM15AG102SH1D: FERRITE BEAD 1 KOHM 0402 1LN; Manufacturer: Murata; Impedance: 1kR; Tolerance: 25%; Max DC Current: 200mA; DC Resistance (DCR): 1R; Test Frequency: 100MHz; Number of Lines: 1; Supplier 1: Digi-Key; Manufacturer Part Number: BLM15AG102SH1D; RoHS: Yes; Category: Ferrite Beads and Chips; Stock 1: 79326; Pricing 1: 1=0.11000, 10=0.09300, 25=0.08320, 50=0.06100, 100=0.05270, 250=0.04164, 500=0.03516, 1000=0.02960, 5000=0.02636 (USD); Mount: Surface Mount; Case/Package: 0402; Core Material: Ferrite; Case Code (Metric): 1005; Case Code (Imperial): 0402; Min Operating Temperature: -55°C; Max Operating Temperature: 125°C; Packaging: Tape and Reel; Package Quantity: 10000; Termination: SMD/SMT; Max Current Rating: 200mA; Number of Circuits: 1; Length: 0.039inch; Width: 0.5mm; Height: 0.022inch; Depth: 0.55mm; Ratings: AEC-Q200; REACH SVHC: No SVHC; ComponentLink1URL: https://datasheet.ciiva.com/29364/l0132s0193blm15a-sh-29364285.pdf?src-supplier=Digi-Key; ComponentLink1Description: https://datasheet.ciiva.com/29364/l0132s0193blm15a-sh-29364285.pdf?src-supplier=Digi-Key; ComponentLink2URL: https://datasheet.ciiva.com/17279/l0132s0193blm15a-sh-17279626.pdf?src-supplier=Avnet+Europe; ComponentLink2Description: https://datasheet.ciiva.com/17279/l0132s0193blm15a-sh-17279626.pdf?src-supplier=Avnet+Europe; ComponentLink3URL: https://datasheet.ciiva.com/8510/l0132s0193blm15a-sh-8510171.pdf?src-supplier=Avnet; ComponentLink3Description: https://datasheet.ciiva.com/8510/l0132s0193blm15a-sh-8510171.pdf?src-supplier=Avnet; ComponentLink4URL: https://datasheet.ciiva.com/29364/l0132s0193blm15a-sh-29364283.pdf?src-supplier=Digi-Key; ComponentLink4Description: https://datasheet.ciiva.com/29364/l0132s0193blm15a-sh-29364283.pdf?src-supplier=Digi-Key; ComponentLink5URL: https://datasheet.ciiva.com/29364/l0132s0193blm15a-sh-29364286.pdf?src-supplier=Digi-Key; ComponentLink5Description: https://datasheet.ciiva.com/29364/l0132s0193blm15a-sh-29364286.pdf?src-supplier=Digi-Key; Supplier Part Number 1: 490-7804-1-ND
R10 = CRCW040210M0FKED: RESISTOR, 0402, 10M, 1%, FULL REEL; Product Range:VISHAY - AEC-Q200 CRCW Series; Resistance:10Mohm; Power Rating:63mW; Resistance Tolerance:± 1%; Resistor Case Style:0402 [1005 Metric]; Resistor Element Material:Thick Film; ;RoHS Compliant: Yes; Manufacturer: Vishay; Resistance: 10MR; Temperature Coefficient: 100ppm/°C; Max Power Dissipation: 63mW; Voltage Rating: 50V; Supplier 1: Digi-Key; Manufacturer Part Number: CRCW040210M0FKED; RoHS: Yes; Category: Chip SMD Resistors; Stock 1: 167645; Pricing 1: 1=0.10000, 10=0.03300, 100=0.01330, 1000=0.00596, 2500=0.00518, 5000=0.00428 (USD); Mount: Surface Mount; Case/Package: 0402; Case Code (Metric): 1005; Case Code (Imperial): 0402; Weight: 2.3E-05oz; Contact Plating: Tin; Min Operating Temperature: -55°C; Max Operating Temperature: 155°C; Resistor Type: Thick Film; Tolerance: 1%; Packaging: Tape and Reel; Number of Terminations: 2; Power Rating: 63mW; Package Quantity: 10; Termination: SMD/SMT; Voltage Rating (DC): 50V; Features: Automotive AEC-Q200; Length: 1mm; Width: 0.02inch; Height: 0.35mm; Depth: 0.5mm; Radiation Hardening: No; REACH SVHC: Unknown; Military Standard: Not; Lead Free: Lead Free; ComponentLink1URL: https://datasheet.ciiva.com/11811/0900766b80d98824-11811586.pdf?src-supplier=RSComponents; ComponentLink1Description: https://datasheet.ciiva.com/11811/0900766b80d98824-11811586.pdf?src-supplier=RSComponents; ComponentLink2URL: https://datasheet.ciiva.com/2463/dcrcwe3-2463089.pdf?src-supplier=Digi-Key; ComponentLink2Description: https://datasheet.ciiva.com/2463/dcrcwe3-2463089.pdf?src-supplier=Digi-Key; ComponentLink3URL: https://datasheet.ciiva.com/2463/dcrcwe3-2463088.pdf?src-supplier=Digi-Key; ComponentLink3Description: https://datasheet.ciiva.com/2463/dcrcwe3-2463088.pdf?src-supplier=Digi-Key; ComponentLink4URL: https://datasheet.ciiva.com/2463/dcrcwe3-2463090.pdf?src-supplier=Digi-Key; ComponentLink4Description: https://datasheet.ciiva.com/2463/dcrcwe3-2463090.pdf?src-supplier=Digi-Key; ComponentLink5URL: https://datasheet.ciiva.com/5552/dcrcwe3-109170-5552597.pdf?src-supplier=Mouser; ComponentLink5Description: https://datasheet.ciiva.com/5552/dcrcwe3-109170-5552597.pdf?src-supplier=Mouser; ComponentLink6URL: https://datasheet.ciiva.com/16881/dcrcwe3-16881451.pdf?src-supplier=Avnet+Europe; ComponentLink6Description: https://datasheet.ciiva.com/16881/dcrcwe3-16881451.pdf?src-supplier=Avnet+Europe; ComponentLink7URL: https://datasheet.ciiva.com/26316/fld-crcw-e3-data-en-26316614.pdf?src-supplier=Distrelec; ComponentLink7Description: https://datasheet.ciiva.com/26316/fld-crcw-e3-data-en-26316614.pdf?src-supplier=Distrelec; ComponentLink8URL: https://datasheet.ciiva.com/16773/70201119-16773258.pdf?src-supplier=Allied+Electronics; ComponentLink8Description: https://datasheet.ciiva.com/16773/70201119-16773258.pdf?src-supplier=Allied+Electronics; Supplier Part Number 1: 541-10.0MLCT-ND
U2 = NX3L1G66: Single pole Single Throw switch

## Sheet Quad_SPI_Memory.SchDoc: Quad SPI Memory
size A; Revision: 1
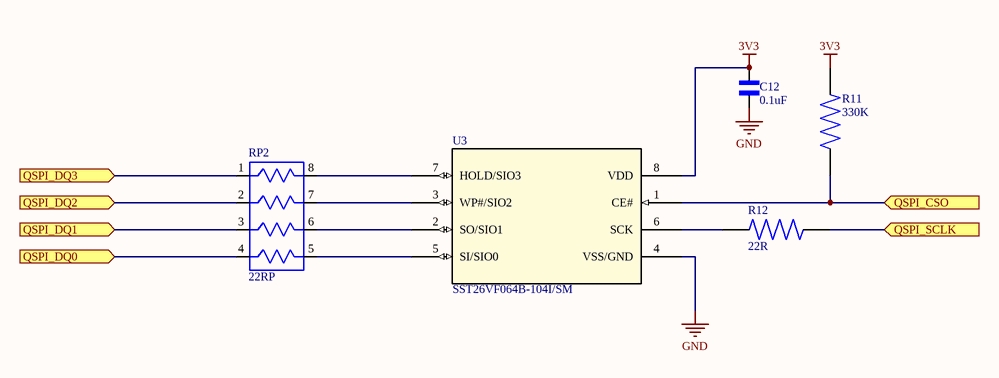
[diagram p3: Quad_SPI_Memory.SchDoc]

### Parts
C12  0.1uF  [C0402]
R11  330K  [R0603 Vishay]
R12  22R  [R0402 Vishay]
RP2  22RP  [RESCAXS50P200X100X55-8N]
U3  SST26VF064B-104I/SM  [SST26VF064B-104V/SM]

### Ports
QSPI_CSO (in), QSPI_DQ0 (in), QSPI_DQ1 (in), QSPI_DQ2 (in), QSPI_DQ3 (in), QSPI_SCLK (in)

### Nets
3V3: C12.2 R11.2 U3.8(VDD)
GND: C12.1 U3.4(VSS/GND)
NetR11_1: R11.1 U3.1(CE#) ; port QSPI_CSO
NetR12_1: R12.1 U3.6(SCK)
NetR12_2: R12.2 ; port QSPI_SCLK
NetRP2_1: RP2.1 ; port QSPI_DQ3
NetRP2_2: RP2.2 ; port QSPI_DQ2
NetRP2_3: RP2.3 ; port QSPI_DQ1
NetRP2_4: RP2.4 ; port QSPI_DQ0
NetRP2_5: RP2.5 U3.5(SI/SIO0)
NetRP2_6: RP2.6 U3.2(SO/SIO1)
NetRP2_7: RP2.7 U3.3(WP#/SIO2)
NetRP2_8: RP2.8 U3.7(HOLD/SIO3)

### Library data of the parts
C12 = GRM022R60J104KE15L: as C5 on sheet Ethernet_Jack; Supplier 1: Digi-Key; Manufacturer Part Number: GRM022R60J104KE15L; RoHS: No; Category: Ceramic Capacitors; Stock 1: 633064; Pricing 1: 1=0.13000, 10=0.09000, 50=0.05080, 100=0.04210, 500=0.02952, 1000=0.02444, 2500=0.02275, 5000=0.02081 (USD); Mount: Surface Mount; Case Code (Imperial): 1005; Case Code (Metric): 0402; Min Operating Temperature: -55°C; Max Operating Temperature: 85°C; Packaging: Cut Tape; Voltage Rating: 6.3V; ComponentLink1URL: http://search.murata.co.jp/Ceramy/image/img/A01X/G101/ENG/GRM022R60J104KE15-01.pdf?src-supplier=Digi-Key; ComponentLink1Description: http://search.murata.co.jp/Ceramy/image/img/A01X/G101/ENG/GRM022R60J104KE15-01.pdf?src-supplier=Digi-Key; Supplier Part Number 1: 490-16598-1-ND
R11 = CRCW0201330KFNED: VISHAY   CRCW0201330KFNED   Surface Mount Chip Resistor, Thick Film, AEC-Q200 CRCW Series, 330 kohm, 50 mW,  1%, 30 V; Resistance: 330kR; Power Rating: 50mW; Voltage Rating: 30V; Temperature Coefficient: 200ppm/°C; Supplier 1: Digi-Key; Manufacturer: Vishay; Manufacturer Part Number: CRCW0201330KFNED; RoHS: Yes; Category: Chip SMD Resistors; Stock 1: 7255; Pricing 1: 1=0.10000, 10=0.05700, 100=0.02300, 1000=0.01034, 2500=0.00897, 5000=0.00741 (USD); Case/Package: 0201; Case Code (Metric): 0603; Case Code (Imperial): 0201; Contact Plating: Tin; Min Operating Temperature: -55°C; Max Operating Temperature: 155°C; Packaging: Tape and Reel; Tolerance: 1%; Package Quantity: 10000; Resistor Type: Thick Film; Number of Terminations: 2; Max Power Dissipation: 50mW; Voltage Rating (DC): 30V; Length: 0.024inch; Width: 0.012inch; Height: 0.011inch; Radiation Hardening: No; REACH SVHC: Unknown; Lead Free: Lead Free; ComponentLink1URL: https://datasheet.ciiva.com/22708/1719906-22708398.pdf?src-supplier=Element14; ComponentLink1Description: https://datasheet.ciiva.com/22708/1719906-22708398.pdf?src-supplier=Element14; Supplier Part Number 1: 541-CRCW0201330KFNEDCT-ND
R12 = CRCW040222R0FKED: VISHAY - CRCW040222R0FKED. - Resistor Case Style:0402 [1005 Metric], 22ohm; Power Rating: 63mW; Tolerance: 1%; Voltage Rating: 50V; Temperature Coefficient: 100ppm/°C; Supplier 1: Digi-Key; Manufacturer: Vishay; Manufacturer Part Number: CRCW040222R0FKED; RoHS: Yes; Category: Chip SMD Resistors; Stock 1: 167744; Pricing 1: 1=0.10000, 10=0.03300, 100=0.01330, 1000=0.00596, 2500=0.00518, 5000=0.00428 (USD); Mount: Surface Mount; Case/Package: 0402; Weight: 2.3E-05oz; Case Code (Metric): 1005; Case Code (Imperial): 0402; Contact Plating: Tin; Min Operating Temperature: -55°C; Max Operating Temperature: 155°C; Resistance: 22R; Packaging: Tape and Reel; Package Quantity: 10; Resistor Type: Thick Film; Number of Terminations: 2; Termination: SMD/SMT; Max Power Dissipation: 63mW; Voltage Rating (DC): 50V; Features: Automotive AEC-Q200; Length: 1mm; Width: 0.02inch; Height: 0.35mm; Depth: 0.5mm; Radiation Hardening: No; Lead Free: Lead Free; REACH SVHC: Unknown; Military Standard: Not; ComponentLink1URL: https://datasheet.ciiva.com/11809/0900766b80d98824-11809869.pdf?src-supplier=RSComponents; ComponentLink1Description: https://datasheet.ciiva.com/11809/0900766b80d98824-11809869.pdf?src-supplier=RSComponents; ComponentLink2URL: https://datasheet.ciiva.com/3256/dcrcwe3-3256250.pdf?src-supplier=Avnet; ComponentLink2Description: https://datasheet.ciiva.com/3256/dcrcwe3-3256250.pdf?src-supplier=Avnet; ComponentLink3URL: https://datasheet.ciiva.com/16776/70201119-16776426.pdf?src-supplier=Allied+Electronics; ComponentLink3Description: https://datasheet.ciiva.com/16776/70201119-16776426.pdf?src-supplier=Allied+Electronics; ComponentLink4URL: https://datasheet.ciiva.com/26316/fld-crcw-e3-data-en-26316666.pdf?src-supplier=Distrelec; ComponentLink4Description: https://datasheet.ciiva.com/26316/fld-crcw-e3-data-en-26316666.pdf?src-supplier=Distrelec; ComponentLink5URL: https://datasheet.ciiva.com/16886/dcrcwe3-16886668.pdf?src-supplier=Avnet+Europe; ComponentLink5Description: https://datasheet.ciiva.com/16886/dcrcwe3-16886668.pdf?src-supplier=Avnet+Europe; ComponentLink6URL: https://datasheet.ciiva.com/7672/1697337-7672781.pdf?src-supplier=Element14; ComponentLink6Description: https://datasheet.ciiva.com/7672/1697337-7672781.pdf?src-supplier=Element14; ComponentLink7URL: https://datasheet.ciiva.com/7672/1697337-7672782.pdf?src-supplier=Element14; ComponentLink7Description: https://datasheet.ciiva.com/7672/1697337-7672782.pdf?src-supplier=Element14; ComponentLink8URL: https://datasheet.ciiva.com/2463/dcrcwe3-2463093.pdf?src-supplier=Digi-Key; ComponentLink8Description: https://datasheet.ciiva.com/2463/dcrcwe3-2463093.pdf?src-supplier=Digi-Key; ComponentLink9URL: https://datasheet.ciiva.com/16396/dcrcwe3-16396918.pdf?src-supplier=Future+Electronics; ComponentLink9Description: https://datasheet.ciiva.com/16396/dcrcwe3-16396918.pdf?src-supplier=Future+Electronics; ComponentLink10URL: https://datasheet.ciiva.com/3256/dcrcwe3-3256249.pdf?src-supplier=Avnet; ComponentLink10Description: https://datasheet.ciiva.com/3256/dcrcwe3-3256249.pdf?src-supplier=Avnet; ComponentLink11URL: https://datasheet.ciiva.com/5552/dcrcwe3-109170-5552201.pdf?src-supplier=Mouser; ComponentLink11Description: https://datasheet.ciiva.com/5552/dcrcwe3-109170-5552201.pdf?src-supplier=Mouser; ComponentLink12URL: https://datasheet.ciiva.com/2463/dcrcwe3-2463091.pdf?src-supplier=Digi-Key; ComponentLink12Description: https://datasheet.ciiva.com/2463/dcrcwe3-2463091.pdf?src-supplier=Digi-Key; ComponentLink13URL: https://datasheet.ciiva.com/2463/dcrcwe3-2463092.pdf?src-supplier=Digi-Key; ComponentLink13Description: https://datasheet.ciiva.com/2463/dcrcwe3-2463092.pdf?src-supplier=Digi-Key; Supplier Part Number 1: 541-22.0LCT-ND
RP2 = YC124-JR-0722RL: RES ARRAY 4 RES 22 OHM 0804; Manufacturer: Yageo; Number of Terminals/Pins: 8; Number of Circuits: 4; Resistance: 22R; Tolerance: 5%; Power Rating: 62.5mW; Voltage Rating: 50V; Circuit Type: Isolated; Temperature Coefficient: 200ppm/°C; Supplier 1: Digi-Key; Manufacturer Part Number: YC124-JR-0722RL; RoHS: Yes; Category: Resistor Arrays; Stock 1: 239833; Pricing 1: 1=0.10000, 10=0.07100, 25=0.05120, 50=0.03900, 100=0.02880, 250=0.02196, 500=0.01756, 1000=0.01293, 5000=0.00927 (USD); Mount: Surface Mount; Case/Package: 0402; Number of Pins: 8; Case Code (Metric): 1005; Case Code (Imperial): 0402; Min Operating Temperature: -55°C; Max Operating Temperature: 155°C; Number of Contacts: 8; Package Quantity: 1; Packaging: Tape and Reel; Number of Elements: 4; Number of Resistors: 4; Power Per Element: 62.5mW; Termination: Convex; Power Dissipation: 62.5mW; Working Voltage: 50V; Length: 0.079inch; Width: 0.039inch; Height: 0.022inch; Terminal Pitch: 0.5mm; Depth: 1mm; Lead Free: Lead Free; REACH SVHC: Unknown; Military Standard: Not; ComponentLink1URL: https://datasheet.ciiva.com/2688/pyu-yc-tc124-51-rohs-l-3-2688672.pdf?src-supplier=Digi-Key; ComponentLink1Description: https://datasheet.ciiva.com/2688/pyu-yc-tc124-51-rohs-l-3-2688672.pdf?src-supplier=Digi-Key; ComponentLink2URL: https://datasheet.ciiva.com/2688/pyu-yc-tc124-51-rohs-l-3-2688673.pdf?src-supplier=Digi-Key; ComponentLink2Description: https://datasheet.ciiva.com/2688/pyu-yc-tc124-51-rohs-l-3-2688673.pdf?src-supplier=Digi-Key; ComponentLink3URL: https://datasheet.ciiva.com/8017/1508227-8017861.pdf?src-supplier=Element14; ComponentLink3Description: https://datasheet.ciiva.com/8017/1508227-8017861.pdf?src-supplier=Element14; ComponentLink4URL: https://datasheet.ciiva.com/7620/442851-7620729.pdf?src-supplier=Element14; ComponentLink4Description: https://datasheet.ciiva.com/7620/442851-7620729.pdf?src-supplier=Element14; ComponentLink5URL: https://datasheet.ciiva.com/8017/1508227-8017862.pdf?src-supplier=Element14; ComponentLink5Description: https://datasheet.ciiva.com/8017/1508227-8017862.pdf?src-supplier=Element14; ComponentLink6URL: https://datasheet.ciiva.com/17067/pyu-yc-tc124-51-rohs-l-3-17067068.pdf?src-supplier=Future+Electronics; ComponentLink6Description: https://datasheet.ciiva.com/17067/pyu-yc-tc124-51-rohs-l-3-17067068.pdf?src-supplier=Future+Electronics; ComponentLink7URL: https://datasheet.ciiva.com/2688/pyu-yc-tc124-51-rohs-l-3-2688671.pdf?src-supplier=Digi-Key; ComponentLink7Description: https://datasheet.ciiva.com/2688/pyu-yc-tc124-51-rohs-l-3-2688671.pdf?src-supplier=Digi-Key; Supplier Part Number 1: YC124J-22CT-ND
U3 = SST26VF064B-104I/SM: Quad SPI Memory; Flash Serial 3V 64Mbit 64M x 1Bit 8-Pin SOIJ; Vendor: Microchip; Built_By: EMA_Cory; SourceLibrary: Microchip_2020-09-08; Datasheet: https://ww1.microchip.com/downloads/en/DeviceDoc/SST26VF064B-SST26VF064BA-2.5V-3.0V-64-Mbit-Serial-Quad-IO-Flash-Memory-Data-Sheet-DS20005119J.pdf; Manufacturer_Part_Number: SST26VF064B-104I/SM; Copyright: Copyright (C) 2018 Accelerated Designs. All rights reserved; RefDes: RefDes; Type: DEV

## Sheet External_Memory_Power_Switch.SchDoc: External Memory Power Switch
size A; Revision: 1
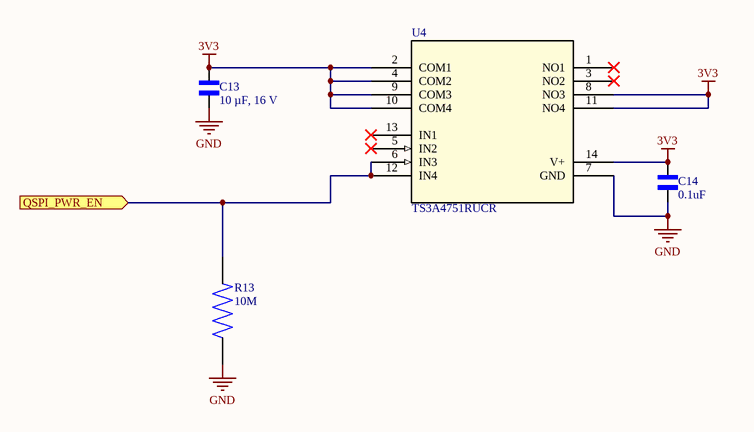
[diagram p4: External_Memory_Power_Switch.SchDoc]

### Parts
C13  10 µF, 16 V  [C0805]
C14  0.1uF  [C0402]
R13  10M  [R0402 Vishay]
U4  TS3A4751RUCR  [TS3A4751RUCR]

### Ports
QSPI_PWR_EN (in)

### Nets
3V3: C13.2 C14.2 U4.2(COM1) U4.4(COM2) U4.8(NO3) U4.9(COM3) U4.10(COM4) U4.11(NO4) U4.14(V+)
GND: C13.1 C14.1 R13.1 U4.7(GND)
NetR13_2: R13.2 U4.6(IN3) U4.12(IN4) ; port QSPI_PWR_EN

Not connected (* = marked no-connect by the designer): U4 1(NO1)* 3(NO2)* 5(IN2)* 13(IN1)*

### Library data of the parts
C13 = C2012X5R1C106K085AC: TDK - C2012X5R1C106K085AC - SMD Multilayer Ceramic Capacitor, 10 µF, 16 V, 0805 [2012 Metric], ± 10%, X5R, C Series TDK; Capacitance: 10uF; Voltage Rating: 16V; Supplier 1: Digi-Key; Manufacturer: TDK; Manufacturer Part Number: C2012X5R1C106K085AC; RoHS: Yes; Category: Ceramic Capacitors; Stock 1: 1442350; Pricing 1: 1=0.25000, 10=0.17500, 100=0.09890, 500=0.06982, 1000=0.06110 (USD); Mount: Surface Mount; Case/Package: 0805; Number of Pins: 2; Weight: 0.000194oz; Case Code (Metric): 2012; Case Code (Imperial): 0805; Dielectric Material: Ceramic; Min Operating Temperature: -55°C; Max Operating Temperature: 85°C; Tolerance: 10%; Packaging: Tape and Reel; Voltage Rating (DC): 16V; Termination: SMD/SMT; Dielectric: X5R; Package Quantity: 1; Composition: Ceramic; Length: 2mm; Height: 0.85mm; Depth: 1.25mm; Width: 0.049inch; Thickness: 0.037inch; Lead Free: Lead Free; REACH SVHC: No SVHC; ComponentLink1URL: https://datasheet.ciiva.com/24218/c2012x5r1c106k085ac-264980-24218056.pdf?src-supplier=Mouser; ComponentLink1Description: https://datasheet.ciiva.com/24218/c2012x5r1c106k085ac-264980-24218056.pdf?src-supplier=Mouser; ComponentLink2URL: https://datasheet.ciiva.com/28451/1796654-28451610.pdf?src-supplier=Element14; ComponentLink2Description: https://datasheet.ciiva.com/28451/1796654-28451610.pdf?src-supplier=Element14; ComponentLink3URL: https://datasheet.ciiva.com/28602/1744655-28602170.pdf?src-supplier=Element14; ComponentLink3Description: https://datasheet.ciiva.com/28602/1744655-28602170.pdf?src-supplier=Element14; ComponentLink4URL: https://datasheet.ciiva.com/6259/tdkmlcccaprange-6259116.pdf?src-supplier=Digi-Key; ComponentLink4Description: https://datasheet.ciiva.com/6259/tdkmlcccaprange-6259116.pdf?src-supplier=Digi-Key; ComponentLink5URL: https://datasheet.ciiva.com/23803/1796654-23803020.pdf?src-supplier=Newark; ComponentLink5Description: https://datasheet.ciiva.com/23803/1796654-23803020.pdf?src-supplier=Newark; ComponentLink6URL: https://datasheet.ciiva.com/22719/1796654-22719549.pdf?src-supplier=Element14; ComponentLink6Description: https://datasheet.ciiva.com/22719/1796654-22719549.pdf?src-supplier=Element14; ComponentLink7URL: https://datasheet.ciiva.com/6259/tdkmlcccaprange-6259119.pdf?src-supplier=Digi-Key; ComponentLink7Description: https://datasheet.ciiva.com/6259/tdkmlcccaprange-6259119.pdf?src-supplier=Digi-Key; ComponentLink8URL: https://datasheet.ciiva.com/28673/mlcc-commercial-general-en-28673535.pdf?src-supplier=Element14; ComponentLink8Description: https://datasheet.ciiva.com/28673/mlcc-commercial-general-en-28673535.pdf?src-supplier=Element14; Supplier Part Number 1: 445-7644-1-ND
C14 = GRM022R60J104KE15L: as C5 on sheet Ethernet_Jack; Supplier 1: Digi-Key; Manufacturer Part Number: GRM022R60J104KE15L; RoHS: No; Category: Ceramic Capacitors; Stock 1: 633064; Pricing 1: 1=0.13000, 10=0.09000, 50=0.05080, 100=0.04210, 500=0.02952, 1000=0.02444, 2500=0.02275, 5000=0.02081 (USD); Mount: Surface Mount; Case Code (Imperial): 1005; Case Code (Metric): 0402; Min Operating Temperature: -55°C; Max Operating Temperature: 85°C; Packaging: Cut Tape; Voltage Rating: 6.3V; ComponentLink1URL: http://search.murata.co.jp/Ceramy/image/img/A01X/G101/ENG/GRM022R60J104KE15-01.pdf?src-supplier=Digi-Key; ComponentLink1Description: http://search.murata.co.jp/Ceramy/image/img/A01X/G101/ENG/GRM022R60J104KE15-01.pdf?src-supplier=Digi-Key; Supplier Part Number 1: 490-16598-1-ND
R13 = CRCW040210M0FKED: as R10 on sheet Ethernet_Switch; Supplier 1: Digi-Key; Manufacturer Part Number: CRCW040210M0FKED; RoHS: Yes; Category: Chip SMD Resistors; Stock 1: 167645; Pricing 1: 1=0.10000, 10=0.03300, 100=0.01330, 1000=0.00596, 2500=0.00518, 5000=0.00428 (USD); Mount: Surface Mount; Case/Package: 0402; Case Code (Metric): 1005; Case Code (Imperial): 0402; Weight: 2.3E-05oz; Contact Plating: Tin; Min Operating Temperature: -55°C; Max Operating Temperature: 155°C; Resistor Type: Thick Film; Tolerance: 1%; Packaging: Tape and Reel; Number of Terminations: 2; Power Rating: 63mW; Package Quantity: 10; Termination: SMD/SMT; Voltage Rating (DC): 50V; Features: Automotive AEC-Q200; Length: 1mm; Width: 0.02inch; Height: 0.35mm; Depth: 0.5mm; Radiation Hardening: No; REACH SVHC: Unknown; Military Standard: Not; Lead Free: Lead Free; ComponentLink1URL: https://datasheet.ciiva.com/11811/0900766b80d98824-11811586.pdf?src-supplier=RSComponents; ComponentLink1Description: https://datasheet.ciiva.com/11811/0900766b80d98824-11811586.pdf?src-supplier=RSComponents; ComponentLink2URL: https://datasheet.ciiva.com/2463/dcrcwe3-2463089.pdf?src-supplier=Digi-Key; ComponentLink2Description: https://datasheet.ciiva.com/2463/dcrcwe3-2463089.pdf?src-supplier=Digi-Key; ComponentLink3URL: https://datasheet.ciiva.com/2463/dcrcwe3-2463088.pdf?src-supplier=Digi-Key; ComponentLink3Description: https://datasheet.ciiva.com/2463/dcrcwe3-2463088.pdf?src-supplier=Digi-Key; ComponentLink4URL: https://datasheet.ciiva.com/2463/dcrcwe3-2463090.pdf?src-supplier=Digi-Key; ComponentLink4Description: https://datasheet.ciiva.com/2463/dcrcwe3-2463090.pdf?src-supplier=Digi-Key; ComponentLink5URL: https://datasheet.ciiva.com/5552/dcrcwe3-109170-5552597.pdf?src-supplier=Mouser; ComponentLink5Description: https://datasheet.ciiva.com/5552/dcrcwe3-109170-5552597.pdf?src-supplier=Mouser; ComponentLink6URL: https://datasheet.ciiva.com/16881/dcrcwe3-16881451.pdf?src-supplier=Avnet+Europe; ComponentLink6Description: https://datasheet.ciiva.com/16881/dcrcwe3-16881451.pdf?src-supplier=Avnet+Europe; ComponentLink7URL: https://datasheet.ciiva.com/26316/fld-crcw-e3-data-en-26316614.pdf?src-supplier=Distrelec; ComponentLink7Description: https://datasheet.ciiva.com/26316/fld-crcw-e3-data-en-26316614.pdf?src-supplier=Distrelec; ComponentLink8URL: https://datasheet.ciiva.com/16773/70201119-16773258.pdf?src-supplier=Allied+Electronics; ComponentLink8Description: https://datasheet.ciiva.com/16773/70201119-16773258.pdf?src-supplier=Allied+Electronics; Supplier Part Number 1: 541-10.0MLCT-ND
U4 = TS3A4751RUCR: https://www.ti.com/product/TS3A4751?HQS=TI-null-null-octopart-df-pf-null-wwe; Vendor: Texas Instruments; PACKAGE_DESIGNATOR: RUC; PIN_COUNT: 14; FAMILY_NAME: ANALOG SWITCH OR MULTIPLEXER (less than or equal to 5V); INDUSTRY_STD_PKG_TYPE: QFN; Manufacturer_Part_Number: TS3A4751RUCR; GENERIC_PART_NUMBER: TS3A4751; Datasheet_URL: http://www.ti.com/lit/gpn/TS3A4751; Manufacturer: Texas Instruments; Copyright: Copyright (C) 2018 Accelerated Designs. All rights reserved; RefDes: RefDes; Type: DEV